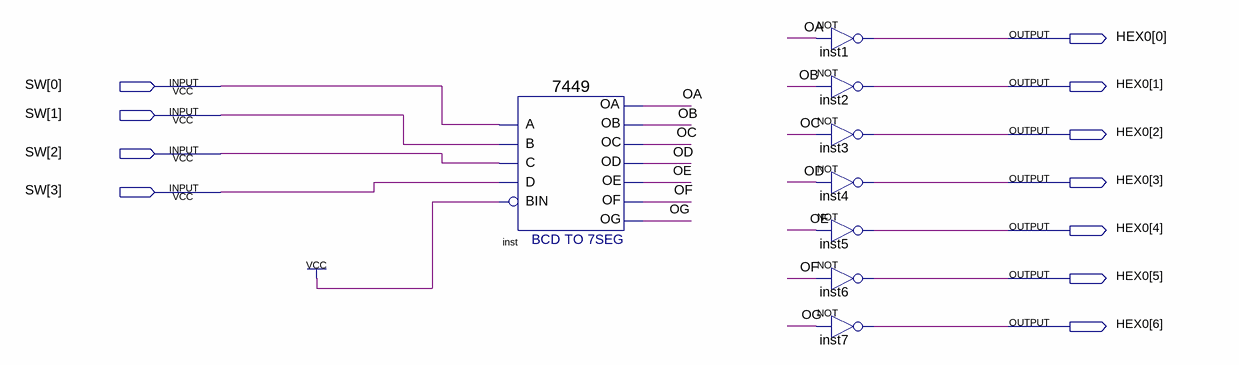
[diagram p0: schematic sheet]
// Quartus schematic projeto2.bdf as structural Verilog: 8 symbols, 11 pins
module projeto2 (
  input  [3:0] SW,
  output [6:0] HEX0
);

  wire OA, OB, OC, OD, OE, OF, OG;

  \7449  inst (
    .A(SW[0]), .C(SW[2]), .B(SW[1]), .D(SW[3]), .BIN(1'b1), .OC(OC), .OD(OD), .OF(OF), .OG(OG), .OB(OB),
    .OA(OA), .OE(OE));
  not inst1 (HEX0[0], OA);
  not inst2 (HEX0[1], OB);
  not inst3 (HEX0[2], OC);
  not inst4 (HEX0[3], OD);
  not inst5 (HEX0[4], OE);
  not inst6 (HEX0[5], OF);
  not inst7 (HEX0[6], OG);
endmodule
